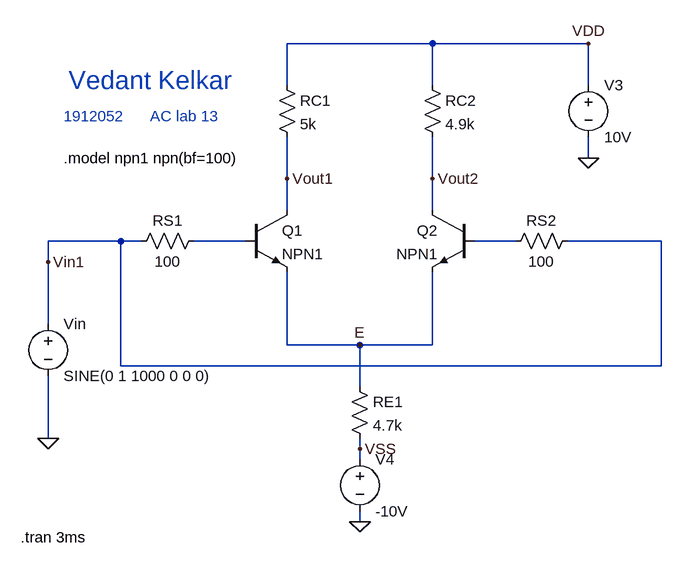
[diagram p0: schematic AC_Lab13c.asc]
AC_Lab13c.asc, the LTspice schematic file:
Version 4
SHEET 1 976 680
WIRE 288 -144 64 -144
WIRE 528 -144 288 -144
WIRE 64 -80 64 -144
WIRE 288 -80 288 -144
WIRE 528 -80 528 -144
WIRE 528 32 528 0
WIRE 64 64 64 0
WIRE 288 64 288 0
WIRE 64 112 64 64
WIRE 288 112 288 64
WIRE -192 160 -304 160
WIRE -160 160 -192 160
WIRE 0 160 -80 160
WIRE 416 160 352 160
WIRE 640 160 496 160
WIRE -304 192 -304 160
WIRE -304 288 -304 192
WIRE 64 320 64 208
WIRE 176 320 64 320
WIRE 288 320 288 208
WIRE 288 320 176 320
WIRE -192 352 -192 160
WIRE 640 352 640 160
WIRE 640 352 -192 352
WIRE 176 384 176 320
WIRE -304 464 -304 368
WIRE 176 480 176 464
WIRE 176 496 176 480
WIRE 176 592 176 576
FLAG -304 464 0
FLAG 176 320 E
FLAG 528 32 0
FLAG 176 592 0
FLAG 528 -144 VDD
FLAG 176 480 VSS
FLAG -304 192 Vin1
FLAG 64 64 Vout1
FLAG 288 64 Vout2
SYMBOL voltage -304 272 R0
WINDOW 123 0 0 Left 0
WINDOW 39 0 0 Left 0
SYMATTR InstName Vin
SYMATTR Value SINE(0 1 1000 0 0 0)
SYMBOL res -64 144 R90
WINDOW 0 0 56 VBottom 2
WINDOW 3 32 56 VTop 2
SYMATTR InstName RS1
SYMATTR Value 100
SYMBOL npn 0 112 R0
SYMATTR InstName Q1
SYMATTR Value NPN1
SYMBOL res 48 -96 R0
SYMATTR InstName RC1
SYMATTR Value 5k
SYMBOL res 512 144 R90
WINDOW 0 0 56 VBottom 2
WINDOW 3 32 56 VTop 2
SYMATTR InstName RS2
SYMATTR Value 100
SYMBOL npn 352 112 M0
SYMATTR InstName Q2
SYMATTR Value NPN1
SYMBOL res 272 -96 R0
SYMATTR InstName RC2
SYMATTR Value 4.9k
SYMBOL res 160 368 R0
SYMATTR InstName RE1
SYMATTR Value 4.7k
SYMBOL voltage 528 -96 R0
WINDOW 123 0 0 Left 0
WINDOW 39 0 0 Left 0
SYMATTR InstName V3
SYMATTR Value 10V
SYMBOL voltage 176 480 R0
WINDOW 123 0 0 Left 0
WINDOW 39 0 0 Left 0
SYMATTR InstName V4
SYMATTR Value -10V
TEXT -272 -88 Left 4 ;Vedant Kelkar
TEXT -280 -32 Left 2 ;1912052      AC lab 13
TEXT -280 32 Left 2 !.model npn1 npn(bf=100)
TEXT -346 616 Left 2 !.tran 3ms

The netlist it stands for:
* AC_Lab13c.asc
Vin Vin1 0 SINE(0 1 1000 0 0 0)
RS1 N001 Vin1 100
Q1 Vout1 N001 E 0 NPN1
RC1 VDD Vout1 5k
RS2 Vin1 N002 100
Q2 Vout2 N002 E 0 NPN1
RC2 VDD Vout2 4.9k
RE1 E VSS 4.7k
V3 VDD 0 10V
V4 VSS 0 -10V
.model NPN NPN
.model PNP PNP
.lib standard.bjt
* Vedant Kelkar
* 1912052      AC lab 13
.model npn1 npn(bf=100)
.tran 3ms
.backanno
.end